# Altium project Lab_Rat_Project.PrjPcb
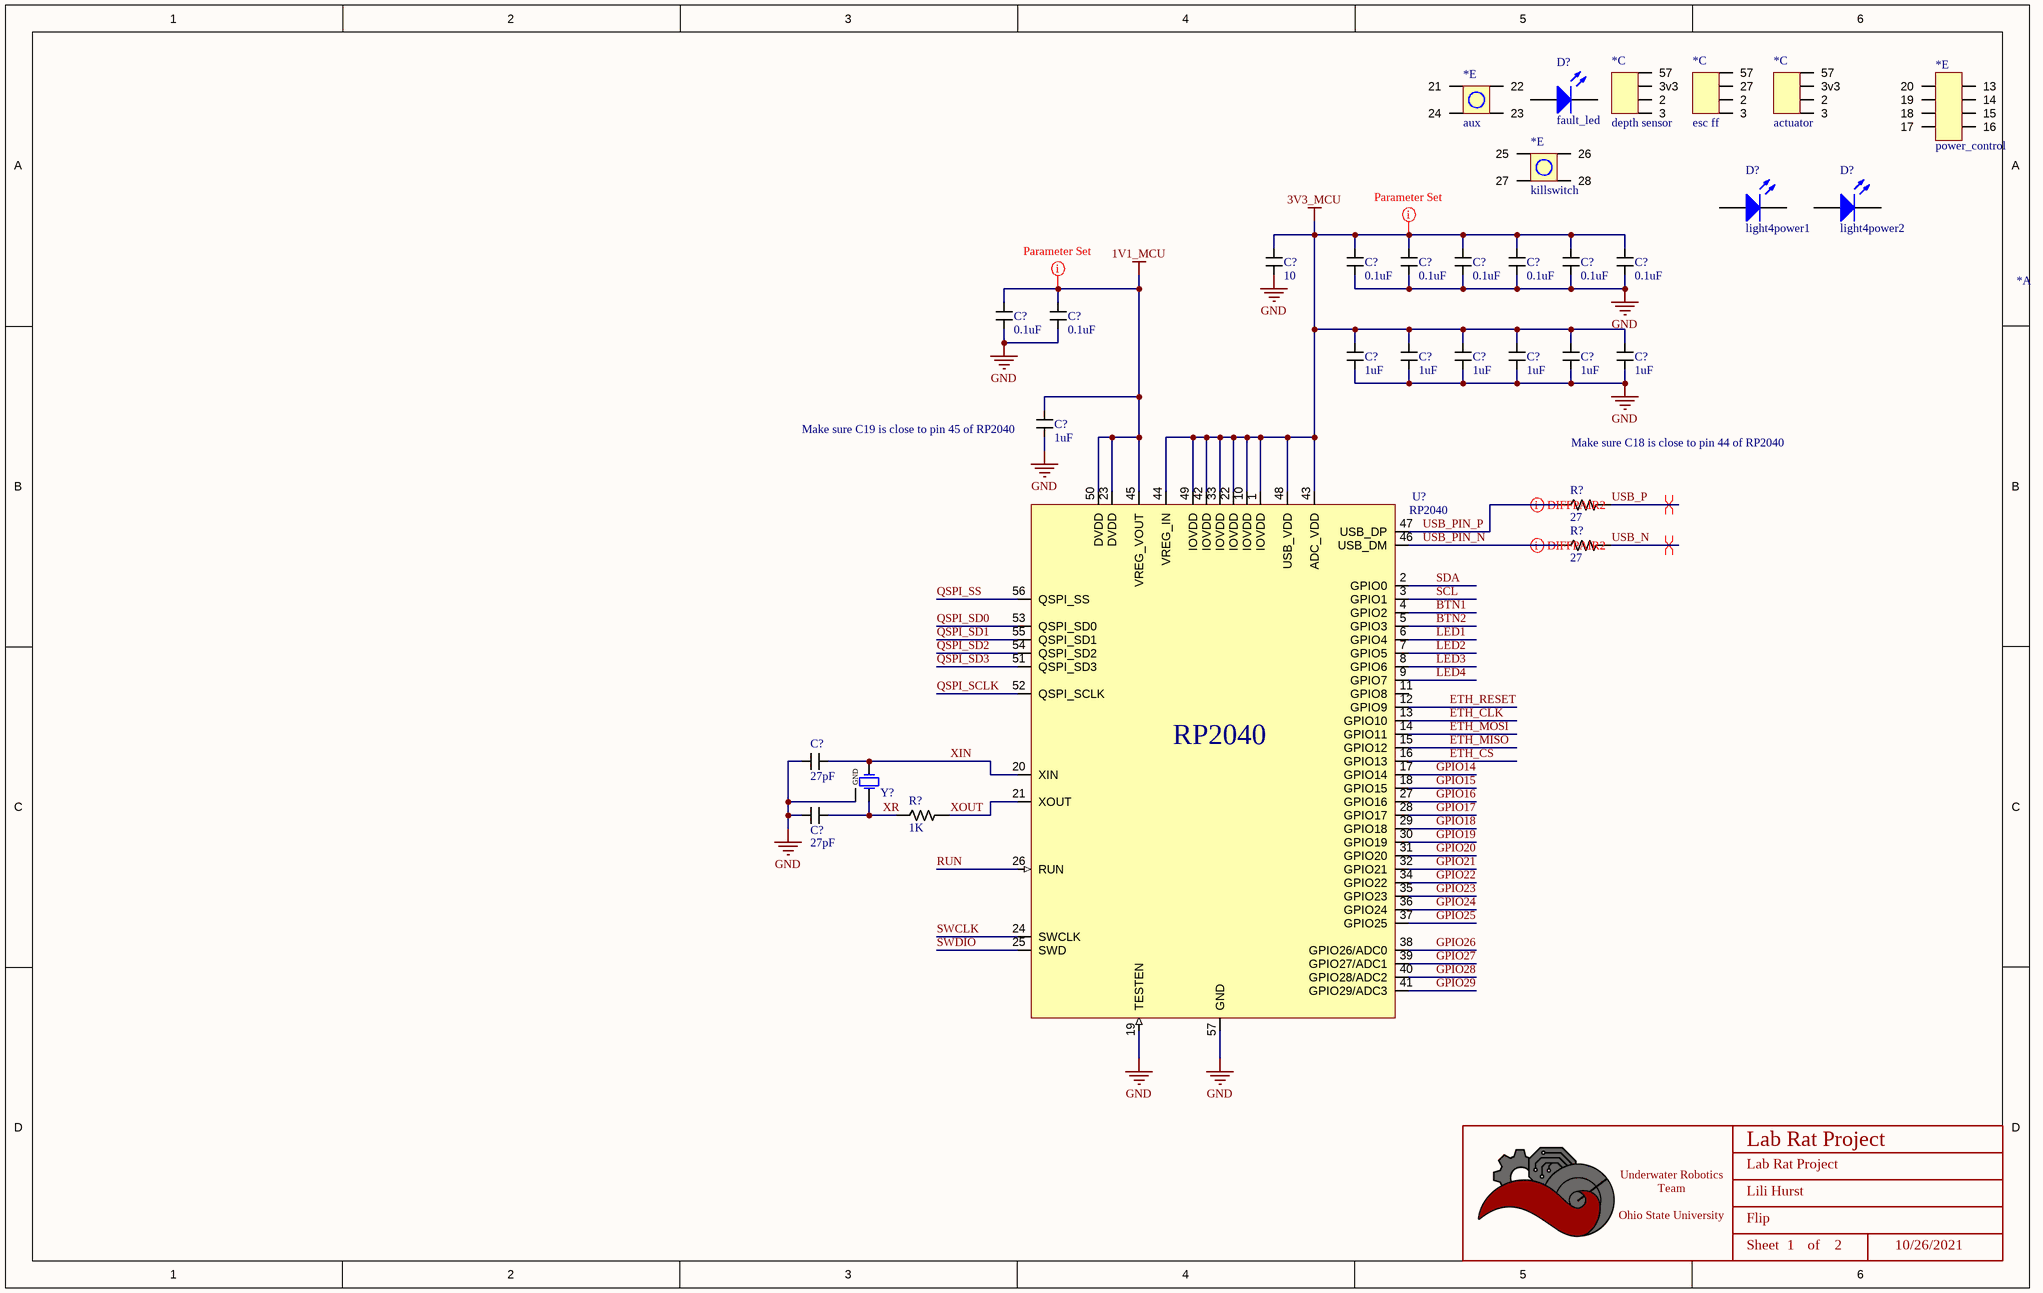
[diagram p0: LabRat.SchDoc]
BoardRevision: 1.0; DateOfDesignReview: XX/XX/XXXX; ProjectTitle: Lab Rat Project; TeamLead: Flip
1 sheet, 34 parts. Net scope: global (net labels, ports and power ports of the same name join across sheets).
Board file: Labrat.PcbDoc

## Sheet LabRat.SchDoc: Lab Rat Project
size B; Date: 10/26/2021; Author: Lili Hurst; Organization: ORGANIZATION; Address1: ADDRESS 1; Address2: ADDRESS 2; Address3: ADDRESS 3; Address4: ADDRESS 4; Revision: -; SheetNumber: 1; SheetTotal: 2; ENG_APP_DATE: --/--/--; DSN_APP_DATE: --/--/--; CHK_APP_DATE: --/--/--

### Parts
(Parts that share a designator on the sheet are numbered #1, #2 ... from top to bottom, then left to right.)
*#1  depth sensor  (part C of 5)
*#2  esc ff  (part C of 5)
*#3  actuator  (part C of 5)
*#4  aux  (part E of 5)
*#5  power_control  (part E of 5)
*#6  killswitch  (part E of 5)
*#7  (no value)  (part A of 3)
*#8  Title_Block  [LOGO]  (value not drawn)  (graphical)
C?#1  Value (uF): 10  [CAPACITOR_0603]  (hidden comment: 10uF Ceramic 6.3V)
C?#2  value 0.1uF  [CAPACITOR_0603]  (hidden comment: 100nF Ceramic 6.3V)
C?#3  value 0.1uF  [CAPACITOR_0603]  (hidden comment: 100nF Ceramic 6.3V)
C?#4  value 0.1uF  [CAPACITOR_0603]  (hidden comment: 100nF Ceramic 6.3V)
C?#5  value 0.1uF  [CAPACITOR_0603]  (hidden comment: 100nF Ceramic 6.3V)
C?#6  value 0.1uF  [CAPACITOR_0603]  (hidden comment: 100nF Ceramic 6.3V)
C?#7  value 0.1uF  [CAPACITOR_0603]  (hidden comment: 100nF Ceramic 6.3V)
C?#8  value 0.1uF  [CAPACITOR_0603]  (hidden comment: 100nF Ceramic 6.3V)
C?#9  value 0.1uF  [CAPACITOR_0603]  (hidden comment: 100nF Ceramic 6.3V)
C?#10  value 1uF  [CAPACITOR_0603]  (hidden comment: 1uF Ceramic 16V)
C?#11  value 1uF  [CAPACITOR_0603]  (hidden comment: 1uF Ceramic 16V)
C?#12  value 1uF  [CAPACITOR_0603]  (hidden comment: 1uF Ceramic 16V)
C?#13  value 1uF  [CAPACITOR_0603]  (hidden comment: 1uF Ceramic 16V)
C?#14  value 1uF  [CAPACITOR_0603]  (hidden comment: 1uF Ceramic 16V)
C?#15  value 1uF  [CAPACITOR_0603]  (hidden comment: 1uF Ceramic 16V)
C?#16  value 1uF  [CAPACITOR_0603]  (hidden comment: 1uF Ceramic 16V)
C?#17  value 27pF  [CAPACITOR_0603]  (hidden comment: 27pF Ceramic 50V)
C?#18  value 27pF  [CAPACITOR_0603]  (hidden comment: 27pF Ceramic 50V)
D?#1  fault_led  [LED-1]
D?#2  light4power1  [LED-0]
D?#3  light4power2  [LED-0]
R?#1  Value  (Ohms): 27  [RESISTOR_0603]  (hidden comment: 27 Ohm 5% 1/8W)
R?#2  Value  (Ohms): 27  [RESISTOR_0603]  (hidden comment: 27 Ohm 5% 1/8W)
R?#3  Value  (Ohms): 1K  [RESISTOR_0603]  (hidden comment: 1k Ohm 5% 1/8W)
U?  RP2040  [QFN-56 RP2040]
Y?  CRYSTAL 12.0000MHZ 18PF SMD  [4-SMD No Lead Crystal]  (value not drawn)

### Nets
1V1_MCU: C?#8.1 C?#9.1 C?#16.1 U?.23(DVDD) U?.45(VREG_VOUT) U?.50(DVDD)
3V3_MCU: C?#1.1 C?#2.1 C?#3.1 C?#4.1 C?#5.1 C?#6.1 C?#7.1 C?#10.1 C?#11.1 C?#12.1 C?#13.1 C?#14.1 C?#15.1 U?.1(IOVDD) U?.10(IOVDD) U?.22(IOVDD) U?.33(IOVDD) U?.42(IOVDD) U?.43(ADC_VDD) U?.44(VREG_IN) U?.48(USB_VDD) U?.49(IOVDD)
GND: C?#1.2 C?#2.2 C?#3.2 C?#4.2 C?#5.2 C?#6.2 C?#7.2 C?#8.2 C?#9.2 C?#10.2 C?#11.2 C?#12.2 C?#13.2 C?#14.2 C?#15.2 C?#16.2 C?#17.2 C?#18.2 U?.19(TESTEN) U?.57(GND) Y?.GND
BTN1: U?.4(GPIO2)
BTN2: U?.5(GPIO3)
ETH_CLK: U?.13(GPIO10)
ETH_CS: U?.16(GPIO13)
ETH_MISO: U?.15(GPIO12)
ETH_MOSI: U?.14(GPIO11)
ETH_RESET: U?.12(GPIO9)
GPIO14: U?.17(GPIO14)
GPIO15: U?.18(GPIO15)
GPIO16: U?.27(GPIO16)
GPIO17: U?.28(GPIO17)
GPIO18: U?.29(GPIO18)
GPIO19: U?.30(GPIO19)
GPIO20: U?.31(GPIO20)
GPIO21: U?.32(GPIO21)
GPIO22: U?.34(GPIO22)
GPIO23: U?.35(GPIO23)
GPIO24: U?.36(GPIO24)
GPIO25: U?.37(GPIO25)
GPIO26: U?.38(GPIO26/ADC0)
GPIO27: U?.39(GPIO27/ADC1)
GPIO28: U?.40(GPIO28/ADC2)
GPIO29: U?.41(GPIO29/ADC3)
LED1: U?.6(GPIO4)
LED2: U?.7(GPIO5)
LED3: U?.8(GPIO6)
LED4: U?.9(GPIO7)
QSPI_SCLK: U?.52(QSPI_SCLK)
QSPI_SD0: U?.53(QSPI_SD0)
QSPI_SD1: U?.55(QSPI_SD1)
QSPI_SD2: U?.54(QSPI_SD2)
QSPI_SD3: U?.51(QSPI_SD3)
QSPI_SS: U?.56(QSPI_SS)
RUN: U?.26(RUN)
SCL: U?.3(GPIO1)
SDA: U?.2(GPIO0)
SWCLK: U?.24(SWCLK)
SWDIO: U?.25(SWD)
USB_N: R?#2.1
USB_P: R?#1.1
USB_PIN_N: R?#2.2 U?.46(USB_DM)
USB_PIN_P: R?#1.2 U?.47(USB_DP)
XIN: C?#17.1 U?.20(XIN) Y?.1
XOUT: R?#3.1 U?.21(XOUT)
XR: C?#18.1 R?#3.2 Y?.2

Not connected (* = marked no-connect by the designer): *#1 2 3 3v3 57; *#2 2 3 27 57; *#3 2 3 3v3 57; *#4 21 22 23 24; *#5 13 14 15 16 17 18 19 20; *#6 25 26 27 28; D?#1 1(A) 2(K); D?#2 1(A) 2(K); D?#3 1(A) 2(K); U? 11(GPIO8)

### Layout directives
differential pair; differential pair class USB 2.0: USB_N, USB_P, USB_PIN_N, USB_PIN_P
rule Supply Nets [Voltage = 1.100]: 1V1_MCU
rule Supply Nets [Voltage = 3.300]: 3V3_MCU

### Notes on the sheet
- (near C?#16) Make sure C19 is close to pin 45 of RP2040
- Make sure C18 is close to pin 44 of RP2040
- DWG. NO.
- REV.
- SHT.
- THIS DOCUMENT AND THE DATA DISCLOSED HEREIN OR HEREWITH IS THE PROPERTY OF ALTIUM LIMITED AND MAY BE FREELY DISTRIBUTED IN WHOLE. NO RIGHTS ARE RESERVED OR EXPRESS OR IMPLIED WARANTEE GIVEN.
- REVISION
- DESCRIPTION
- DATE
- APPROVED
- ENG:
- APPROVALS
- PROJECT
- DSN:
- CHK:
- REFERENCE DOCUMENTS
- PROJECT REVISION:
- TITLE
- DOCUMENT REVISION:
- DESIGN ITEM:
- BOM:
- FAB DWG:
- PCB DWG:
- ASSY DWG:
- SCALE:
- SIZE
- B
- CAGE CODE
- FILE NAME
- DWG NO.
- SHEET
- OF
- REV
- (in symbol Title_Block) Underwater Robotics Team / Ohio State University; Sheet; of

### Library data of the parts
*#1-*#3 = pin_boards
*#4 *#6 = smpinboard
*#5 = pin board
*#7 = Component_1
*#8 = Title_Block: UWRT Schematic Title Block Template / Created June 2021, Dylan Trainor
C?#1 = CAPACITOR_10uF_0603: Cap 10uF 6.3V +/-20% / Ceramic 0603; Made By: Flip B; ComponentLink1Description: Digikey; ComponentLink1URL: https://www.digikey.com/en/products/detail/samsung-electro-mechanics/CL10A106MQ8NNNC/3886777; Supplier 1: Digi-Key; Supplier Part Number 1: 1276-1119-1-ND; Tolerance: +/- 20%; Voltage: 6.3V
C?#2-C?#9 = CAPACITOR_0.1uF_0603: Cap 100nF 6.3V +/-10% / Ceramic 0603; Made By: Flip B; ComponentLink1Description: Datsheet; ComponentLink1URL: https://www.mouser.com/datasheet/2/212/KEM_C1002_X7R_SMD-1102033.pdf; Tolerance: +/- 10%; Voltage: 6.3V; Supplier 1: Digi-Key; Supplier Part Number 1: 399-15351-1-ND
C?#10-C?#16 = CAPACITOR_1uF_0603: Cap 1uF 16V +/-10% / Ceramic 0603; Made By: Flip B; Tolerance: +/- 10%; Voltage: 16V; Supplier 1: Digi-Key; Supplier Part Number 1: 399-7847-1-ND
C?#17 C?#18 = CAPACITOR_0.000027uF_0603: Cap 27pF 50V +/-5% / Ceramic 0603; Made By: Flip B; ComponentLink1Description: Datsheet; ComponentLink1URL: https://www.mouser.com/datasheet/2/212/KEM_C1002_X7R_SMD-1102033.pdf; Tolerance: +/- 5%; Voltage: 50V; Supplier 1: Digi-Key; Supplier Part Number 1: 311-1063-1-ND
D?#1 = LED1: Typical RED GaAs LED; Published: 8-Jun-2000; LatestRevisionDate: 08-Jul-2005; LatestRevisionNote: Mech Layer 1 removed.; PackageReference: LED-1; Publisher: Altium Limited; PackageDescription: LED; 2 Leads
D?#2 D?#3 = LED0: Typical INFRARED GaAs LED; Published: 8-Jun-2000; LatestRevisionDate: 08-Jul-2005; LatestRevisionNote: Mech Layer 1 removed.; PackageReference: LED-0; Publisher: Altium Limited; PackageDescription: LED; 2 Leads
R?#1 R?#2 = RESISTOR_27_0603: RES 27 OHM 5% 1/8W 0603; Tolerance: +/- 5%; Made By: Robert Pafford; ComponentLink1Description: Datasheet; ComponentLink1URL: https://www.bourns.com/docs/product-datasheets/CRxxxxx.pdf; Wattage: 1/8W; Supplier: Digikey; Digikey Part Numer: CR0603-JW-104ELFTR-ND; Supplier 1: Digi-Key; Supplier Part Number 1: 2019-RK73B1JTTD270JCT-ND
R?#3 = RESISTOR_1K_0603: RES 1k OHM 5% 1/8W 0603; Tolerance: +/- 5%; Made By: Robert Pafford; ComponentLink1Description: Datasheet; ComponentLink1URL: https://www.bourns.com/docs/product-datasheets/CRxxxxx.pdf; Wattage: 1/8W; Supplier: Digikey; Digikey Part Numer: CR0603-JW-104ELFTR-ND; Supplier 1: Digi-Key; Supplier Part Number 1: 2019-RK73B1JTTD102JCT-ND
U? = RP2040: Raspberry Pi RP2040; ComponentLink1Description: DigiKey; ComponentLink1URL: *
Y? = CRYSTAL_12MHz_SMD: 12 MHz ±20ppm Crystal 18pF 50 Ohms 4-SMD, No Lead; pin to pad: 2>3 GND>2+4; Made By: Robert Pafford; Frequency: 12 MHz; ESR: 50 Ohmz; Supplier 1: Digi-Key; Supplier Part Number 1: XC3080CT-ND; Load Capacitance: 18pF